# EAGLE schematic Front Door TinkerAccess (EAGLE 9.6.2)

## Sheet 1 of 3
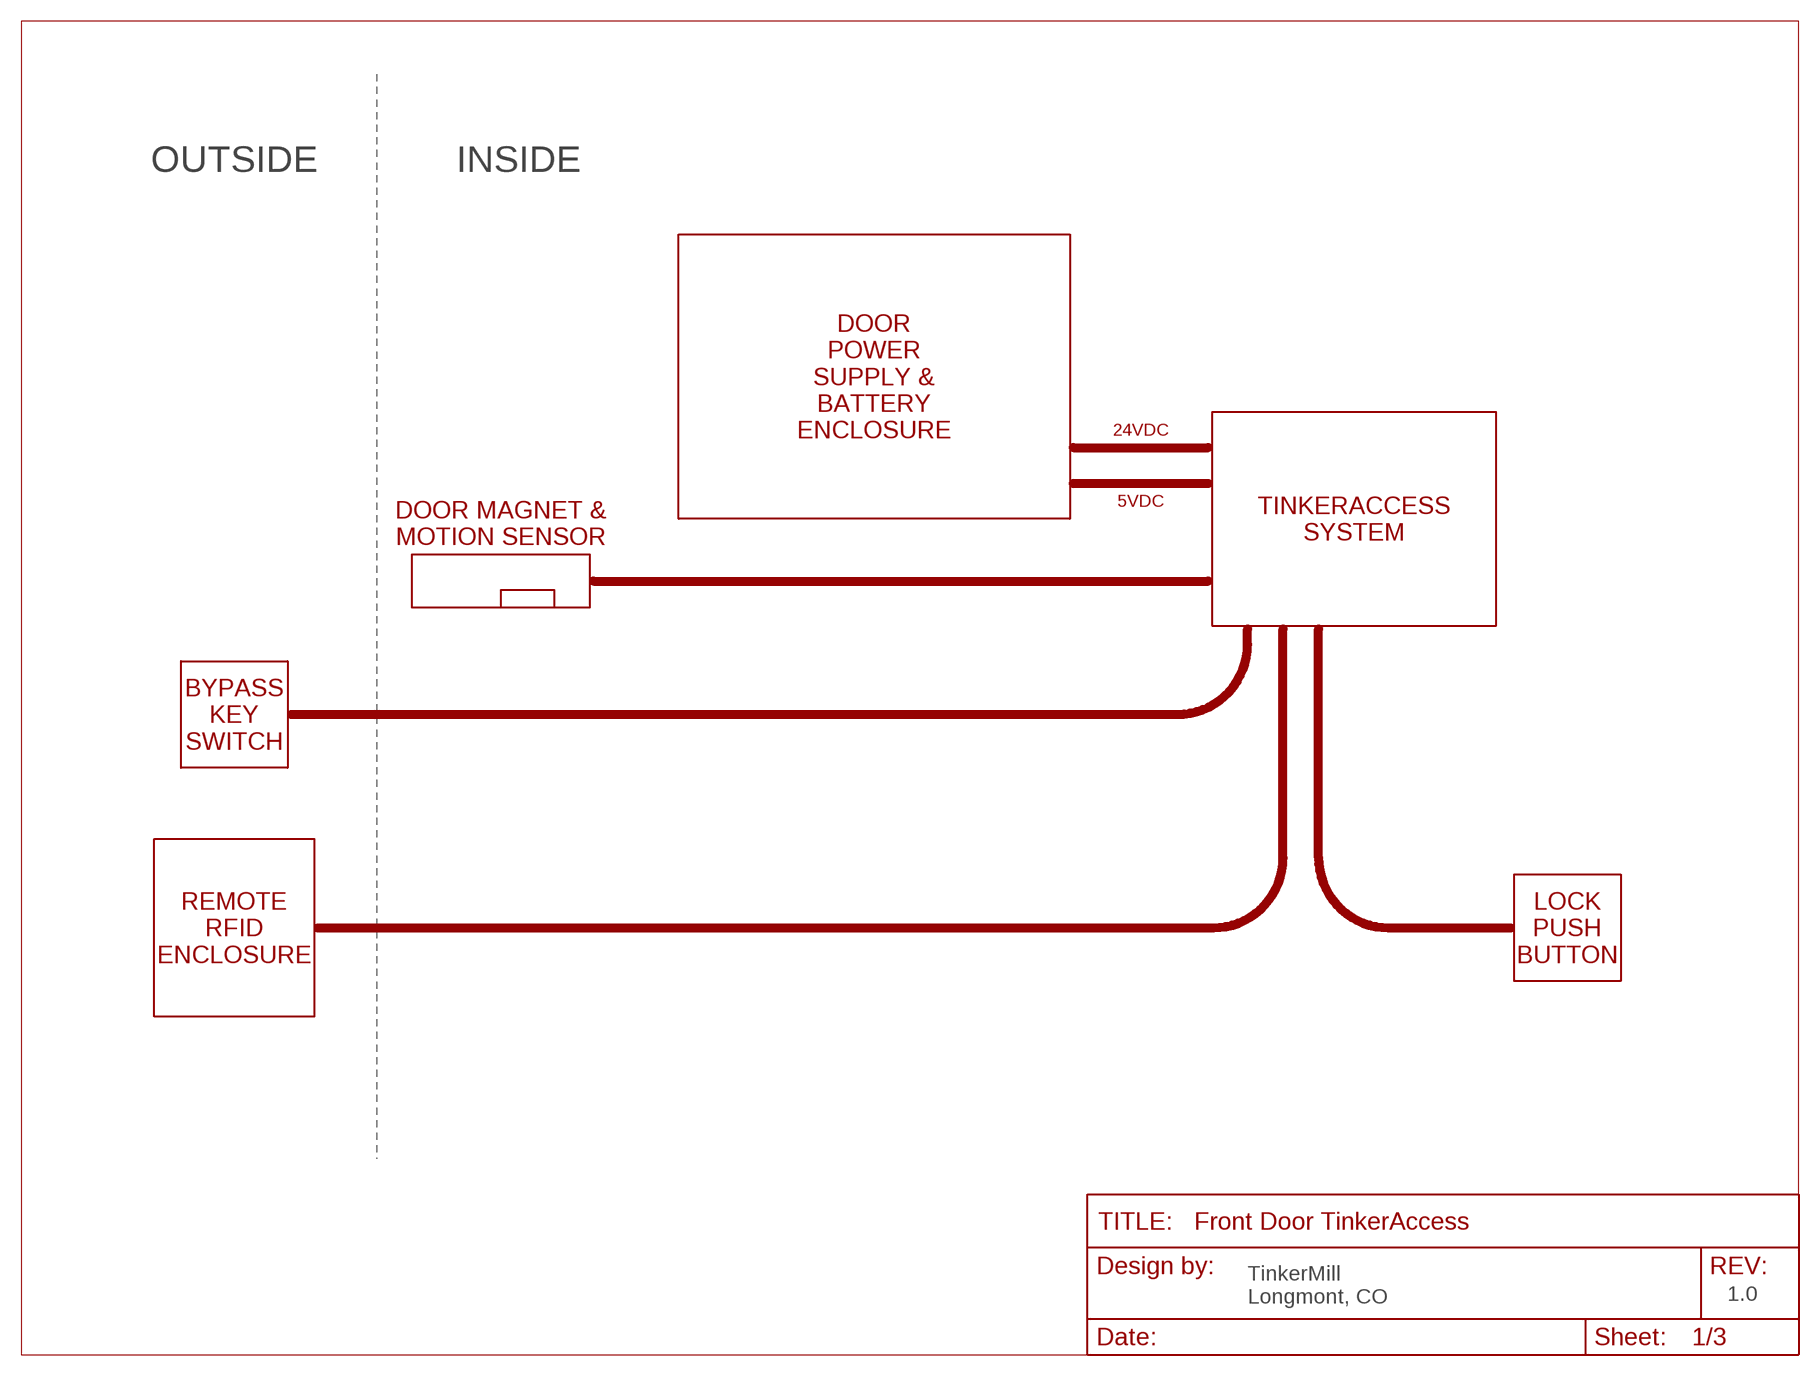
[diagram p0: schematic, sheet 1]

### Notes on the sheet
- OUTSIDE | INSIDE
- DOOR
  POWER
  SUPPLY &
  BATTERY
  ENCLOSURE
- 24VDC
- 5VDC
- TINKERACCESS
  SYSTEM
- DOOR MAGNET &
  MOTION SENSOR
- BYPASS
  KEY
  SWITCH
- REMOTE
  RFID
  ENCLOSURE
- LOCK
  PUSH
  BUTTON
- TinkerMill
  Longmont, CO
- 1.0

## Sheet 2 of 3
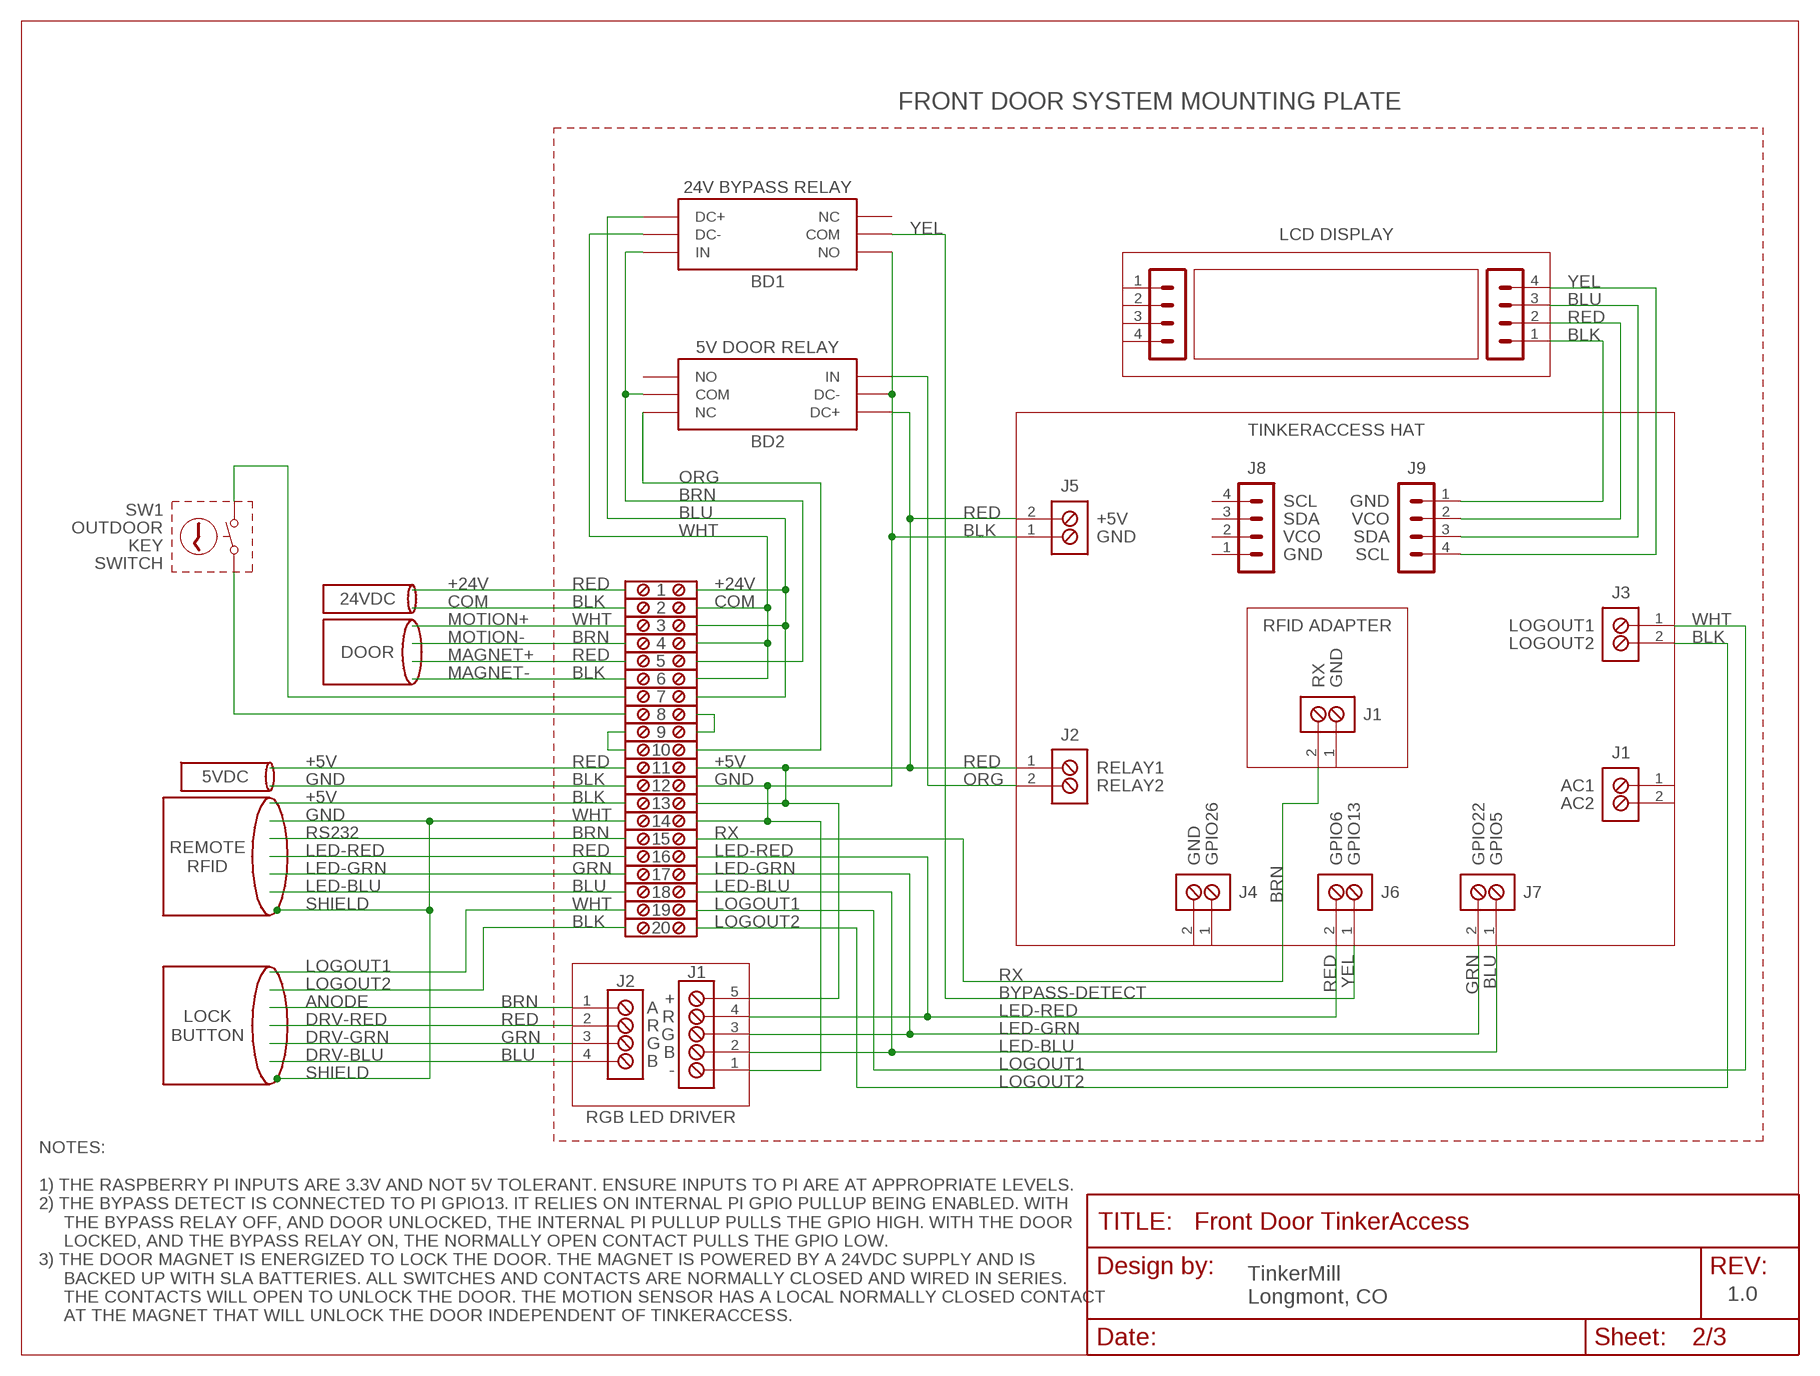
[diagram p1: schematic, sheet 2]

### Parts
BD1  24V BYPASS RELAY  RELAY_MODULE  (no package)
BD2  5V DOOR RELAY  RELAY_MODULE  (no package)
J1  TB_2X1_TE_CONN_ED555_2DS  [TE_CONN_ED555_2DS]
J2  TB_2X1_TE_CONN_ED555_2DS  [TE_CONN_ED555_2DS]
J3  TB_2X1_TE_CONN_ED555_2DS  [TE_CONN_ED555_2DS]
J4  TB_2X1_TE_CONN_ED555_2DS  [TE_CONN_ED555_2DS]
J5  TB_2X1_TE_CONN_ED555_2DS  [TE_CONN_ED555_2DS]
J6  TB_2X1_TE_CONN_ED555_2DS  [TE_CONN_ED555_2DS]
J7  TB_2X1_TE_CONN_ED555_2DS  [TE_CONN_ED555_2DS]
J8  HDR_4X1_2.54MM_LOCKING_RA  [HDR_4X1_2.54MM_LOCKING_RA]
J9  HDR_4X1_2.54MM_LOCKING_RA  [HDR_4X1_2.54MM_LOCKING_RA]
J10  HDR_4X1_2.54MM_LOCKING_RA  [HDR_4X1_2.54MM_LOCKING_RA]
J11  HDR_4X1_2.54MM_LOCKING_RA  [HDR_4X1_2.54MM_LOCKING_RA]
J12  J1  TB_2X1_TE_CONN_ED555_2DS  [TE_CONN_ED555_2DS]
J14  J2  TB_4X1_ON_SHORE_OSTVN04A150  [ON_SHORE_OSTVN04A150]
J15  J1  TB_5X1_ON_SHORE_OSTVN05A150  [ON_SHORE_OSTVN05A150]
SW1  OUTDOOR  KEYED_SWITCH  (no package)
TB1  TERMINAL_BLOCK  (no package)
TB2  TERMINAL_BLOCK  (no package)
TB3  TERMINAL_BLOCK  (no package)
TB5  TERMINAL_BLOCK  (no package)
TB6  TERMINAL_BLOCK  (no package)
TB7  TERMINAL_BLOCK  (no package)
TB8  TERMINAL_BLOCK  (no package)
TB9  TERMINAL_BLOCK  (no package)
TB13  TERMINAL_BLOCK  (no package)
TB14  TERMINAL_BLOCK  (no package)
TB16  TERMINAL_BLOCK  (no package)
TB17  TERMINAL_BLOCK  (no package)
TB18  TERMINAL_BLOCK  (no package)
TB19  TERMINAL_BLOCK  (no package)
TB20  TERMINAL_BLOCK  (no package)
TB21  TERMINAL_BLOCK  (no package)
TB22  TERMINAL_BLOCK  (no package)
TB23  TERMINAL_BLOCK  (no package)
TB24  TERMINAL_BLOCK  (no package)
TB25  TERMINAL_BLOCK  (no package)

### Nets
5V-BLK: TB25.A
5V-RED: TB24.A
24V-BLK: TB14.A
24V-RED: TB13.A
+5V: BD2.DC+ J2.1 J5.2 J15.5 TB1.B TB24.B
+24V: BD1.DC+ TB13.B TB16.B TB17.B
BYPASS-DETECT: BD1.COM J6.1
COM: BD1.DC- TB14.B TB18.B TB20.B
CONTACT1: TB21.B TB22.B
CONTACT2: BD2.NC TB23.B
DOOR-BLK: TB19.A
DOOR-BRN: TB18.A
DOOR-RED: TB20.A
DOOR-RELAY: BD2.IN J2.2
DOOR-WHT: TB17.A
GND: BD1.NO BD2.DC- J5.1 J15.1 TB2.B TB25.B
KEYSW-1: SW1.1 TB16.A
KEYSW-2: SW1.2 TB21.A
LCD-GND: J9.1 J11.1
LCD-SCL: J9.4 J11.4
LCD-SDA: J9.3 J11.3
LCD-VCO: J9.2 J11.2
LED-BLU: J7.1 J15.2 TB7.B
LED-GRN: J7.2 J15.3 TB6.B
LED-RED: J6.2 J15.4 TB5.B
LOCK-BLK: TB8.A ; also sheet 3
LOCK-BLU: J14.4
LOCK-BRN: J14.1 ; also sheet 3
LOCK-GRN: J14.3
LOCK-RED: J14.2
LOCK-WHT: TB9.A ; also sheet 3
LOGOUT1: J3.1 TB9.B ; also sheet 3
LOGOUT2: J3.2 TB8.B ; also sheet 3
MAGNET+: BD1.IN BD2.COM TB19.B
N$1: TB22.A TB23.A
REMOTE-BLK: TB1.A ; also sheet 3
REMOTE-BLU: TB7.A ; also sheet 3
REMOTE-BRN: TB3.A ; also sheet 3
REMOTE-GRN: TB6.A ; also sheet 3
REMOTE-RED: TB5.A ; also sheet 3
REMOTE-WHT: TB2.A ; also sheet 3
RX: J12.2 TB3.B
Unconnected: BD1.NC BD2.NO J1.1 J1.2 J4.1 J4.2 J8.1 J8.2 J8.3 J8.4 J10.1 J10.2 J10.3 J10.4 J12.1

### Notes on the sheet
- FRONT DOOR SYSTEM MOUNTING PLATE
- YEL | LCD DISPLAY
- YEL
- BLU
- RED
- BLK
- TINKERACCESS HAT
- ORG
- BRN | SCL | GND
- BLU | RED | +5V | SDA | VCO
- WHT | BLK | GND | VCO | SDA
- KEY
- GND | SCL
- SWITCH
- +24V | RED | 1
- 24VDC
- COM | BLK | 2
- MOTION+ | WHT | 3 | RFID ADAPTER | LOGOUT1 | WHT
- MOTION- | BRN | 4 | LOGOUT2 | BLK
- DOOR
- MAGNET+ | RED | 5
- MAGNET- | BLK | 6
- RX | GND
- 7
- 8
- 9
- 10
- +5V | RED | 11 | RED | RELAY1
- 5VDC
- GND | BLK | 12 | ORG | RELAY2 | AC1
- +5V | BLK | 13 | AC2
- GND | WHT | 14
- RS232 | BRN | 15
- REMOTE
  RFID
- LED-RED | RED | 16
- GND | GPIO26 | BRN | GPIO6 | GPIO13 | GPIO22 | GPIO5
- LED-GRN | GRN | 17
- LED-BLU | BLU | 18
- SHIELD | WHT | 19
- BLK | 20
- RED | YEL | GRN | BLU
- +
- ANODE | BRN | A
- R
- LOCK
  BUTTON
- DRV-RED | RED | R
- G
- DRV-GRN | GRN | G
- B
- DRV-BLU | BLU | B
- -
- SHIELD
- RGB LED DRIVER
- NOTES:
  
  1) THE RASPBERRY PI INPUTS ARE 3.3V AND NOT 5V TOLERANT. ENSURE INPUTS TO PI ARE AT APPROPRIATE LEVELS.
  2) THE BYPASS DETECT IS CONNECTED TO PI GPIO13. IT RELIES ON INTERNAL PI GPIO PULLUP BEING ENABLED. WITH
       THE BYPASS RELAY OFF, AND DOOR UNLOCKED, THE INTERNAL PI PULLUP PULLS THE GPIO HIGH. WITH THE DOOR
       LOCKED, AND THE BYPASS RELAY ON, THE NORMALLY OPEN CONTACT PULLS THE GPIO LOW.
  3) THE DOOR MAGNET IS ENERGIZED TO LOCK THE DOOR. THE MAGNET IS POWERED BY A 24VDC SUPPLY AND IS
       BACKED UP WITH SLA BATTERIES. ALL SWITCHES AND CONTACTS ARE NORMALLY CLOSED AND WIRED IN SERIES.
       THE CONTACTS WILL OPEN TO UNLOCK THE DOOR. THE MOTION SENSOR HAS A LOCAL NORMALLY CLOSED CONTACT
       AT THE MAGNET THAT WILL UNLOCK THE DOOR INDEPENDENT OF TINKERACCESS.
- TinkerMill
  Longmont, CO
- 1.0

## Sheet 3 of 3
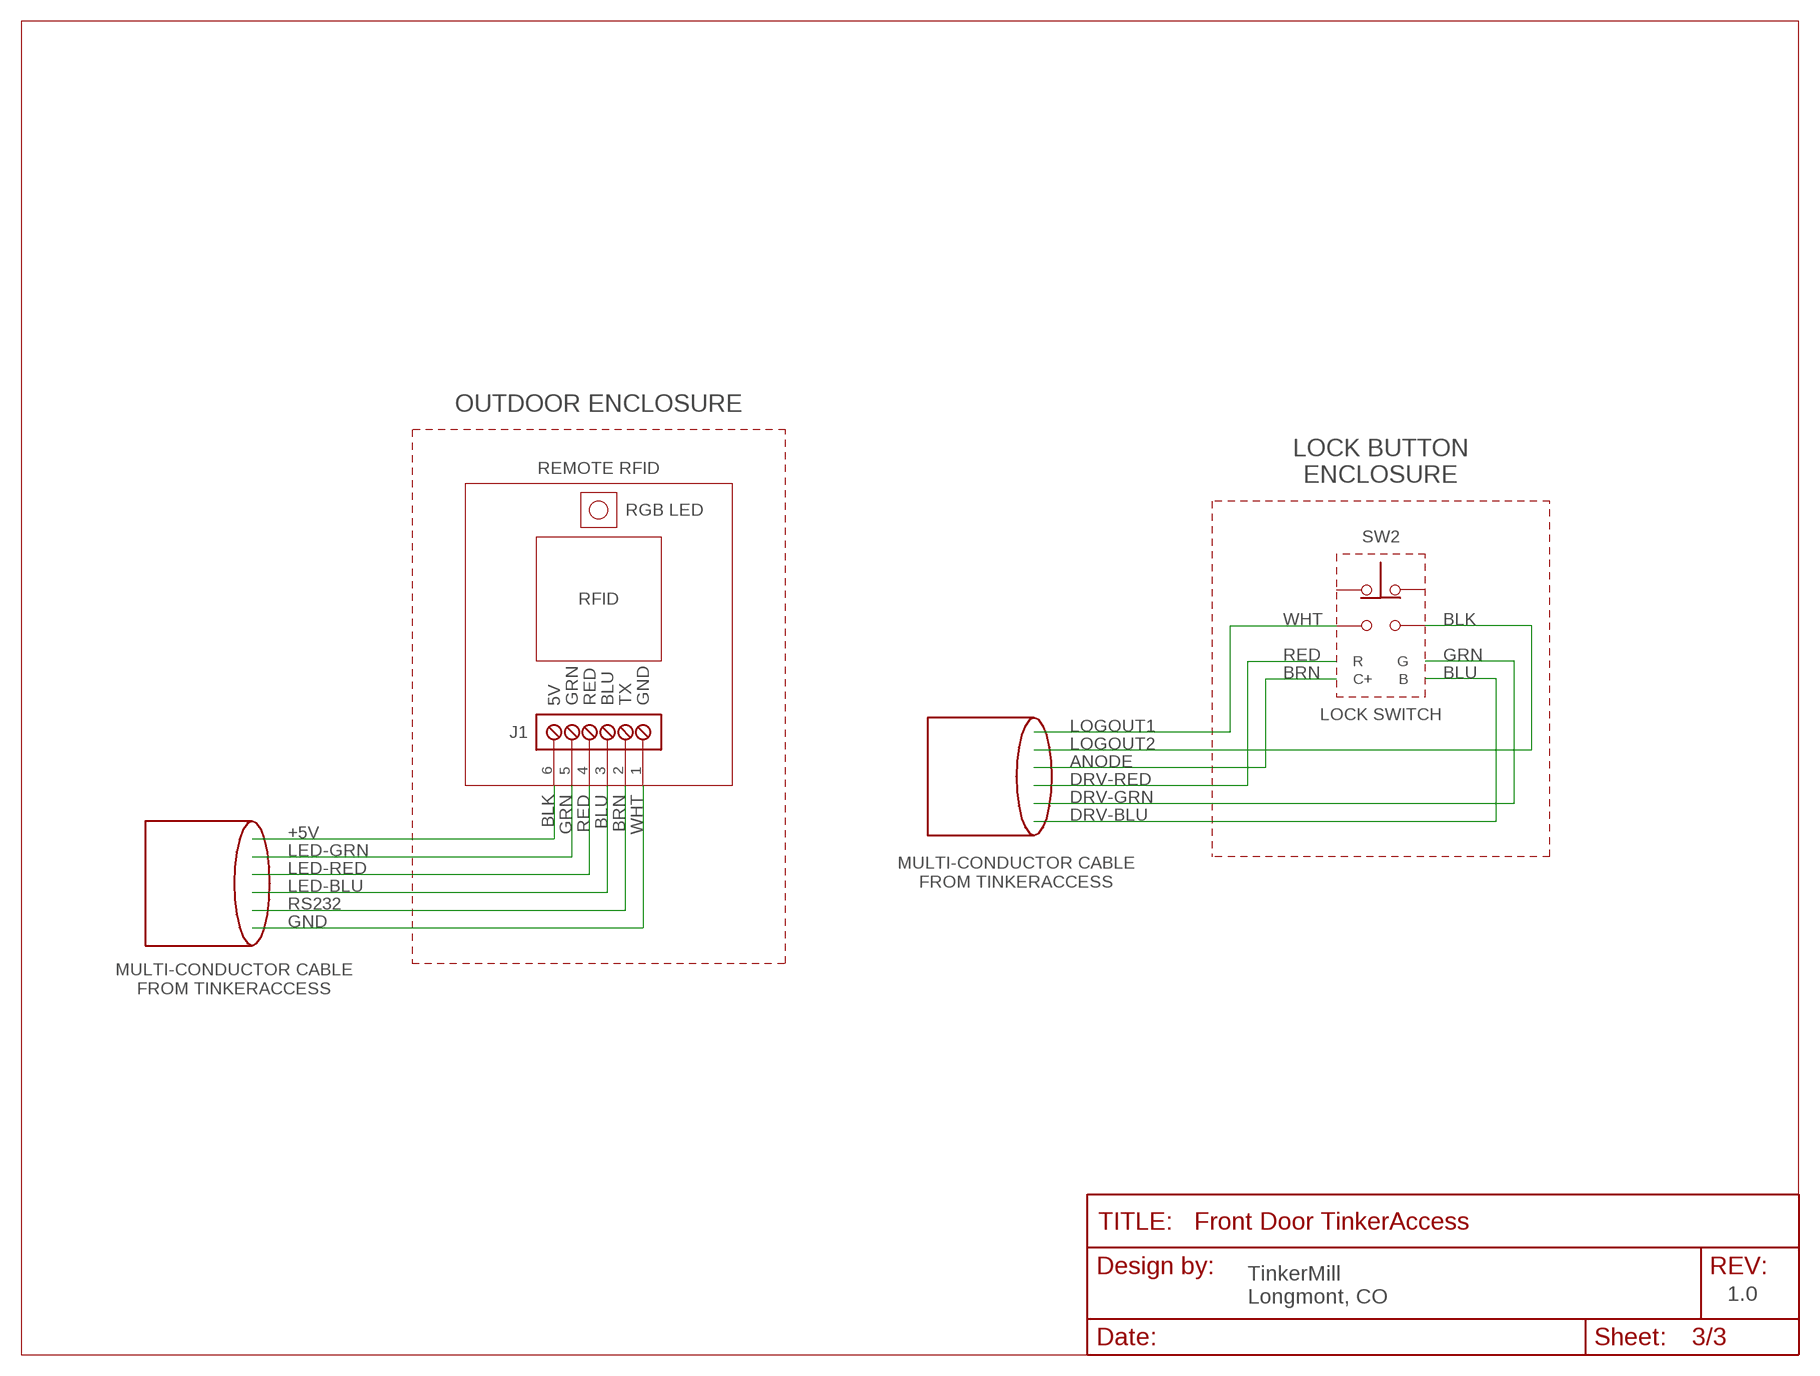
[diagram p2: schematic, sheet 3]

### Parts
J13  J1  TB_6X1_TE_CONN_ED555_6DS  [TE_CONN_ED555_6DS]
SW2  LOCK SWITCH  RGB_SWITCH  (no package)

### Nets
LOCK-BLK: SW2.4 ; also sheet 2
LOCK-BRN: SW2.B ; also sheet 2
LOCK-WHT: SW2.3 ; also sheet 2
REMOTE-BLK: J13.6 ; also sheet 2
REMOTE-BLU: J13.3 SW2.G ; also sheet 2
REMOTE-BRN: J13.2 ; also sheet 2
REMOTE-GRN: J13.5 SW2.R ; also sheet 2
REMOTE-RED: J13.4 SW2.C+ ; also sheet 2
REMOTE-WHT: J13.1 ; also sheet 2
Unconnected: SW2.1 SW2.2

### Notes on the sheet
- OUTDOOR ENCLOSURE
- REMOTE RFID
- LOCK BUTTON
  ENCLOSURE
- RGB LED
- RFID
- WHT | BLK
- RED | GRN
- BRN | BLU
- 5V | GRN | RED | BLU | TX | GND
- ANODE
- DRV-RED
- BLK | GRN | RED | BLU | BRN | WHT
- DRV-GRN
- DRV-BLU
- +5V
- LED-GRN
- MULTI-CONDUCTOR CABLE
  FROM TINKERACCESS
- LED-RED
- LED-BLU
- RS232
- GND
- MULTI-CONDUCTOR CABLE
  FROM TINKERACCESS
- TinkerMill
  Longmont, CO
- 1.0

## Library data of the parts
BD1 BD2 = TMF_Schematic_Only:RELAY_MODULE
J1-J7 J12 = TMF_Connectors:TB_2X1
J8-J11 = TMF_Connectors:HDR_4X1
J13 = TMF_Connectors:TB_6X1
J14 = TMF_Connectors:TB_4X1
J15 = TMF_Connectors:TB_5X1
SW1 = TMF_Schematic_Only:KEYED_SWITCH
SW2 = TMF_Schematic_Only:RGB_SWITCH
TB1-TB3 TB5-TB9 TB13 TB14 TB16-TB25 = TMF_Schematic_Only:TERMINAL_BLOCK